# Altium schematic sheet RobotCtrl_V2_Core-board.SchDoc
size A3; Author: Power Lin; DocumentNumber: 1; SheetNumber: 1; SheetTotal: 1; Website: wiki-power.com
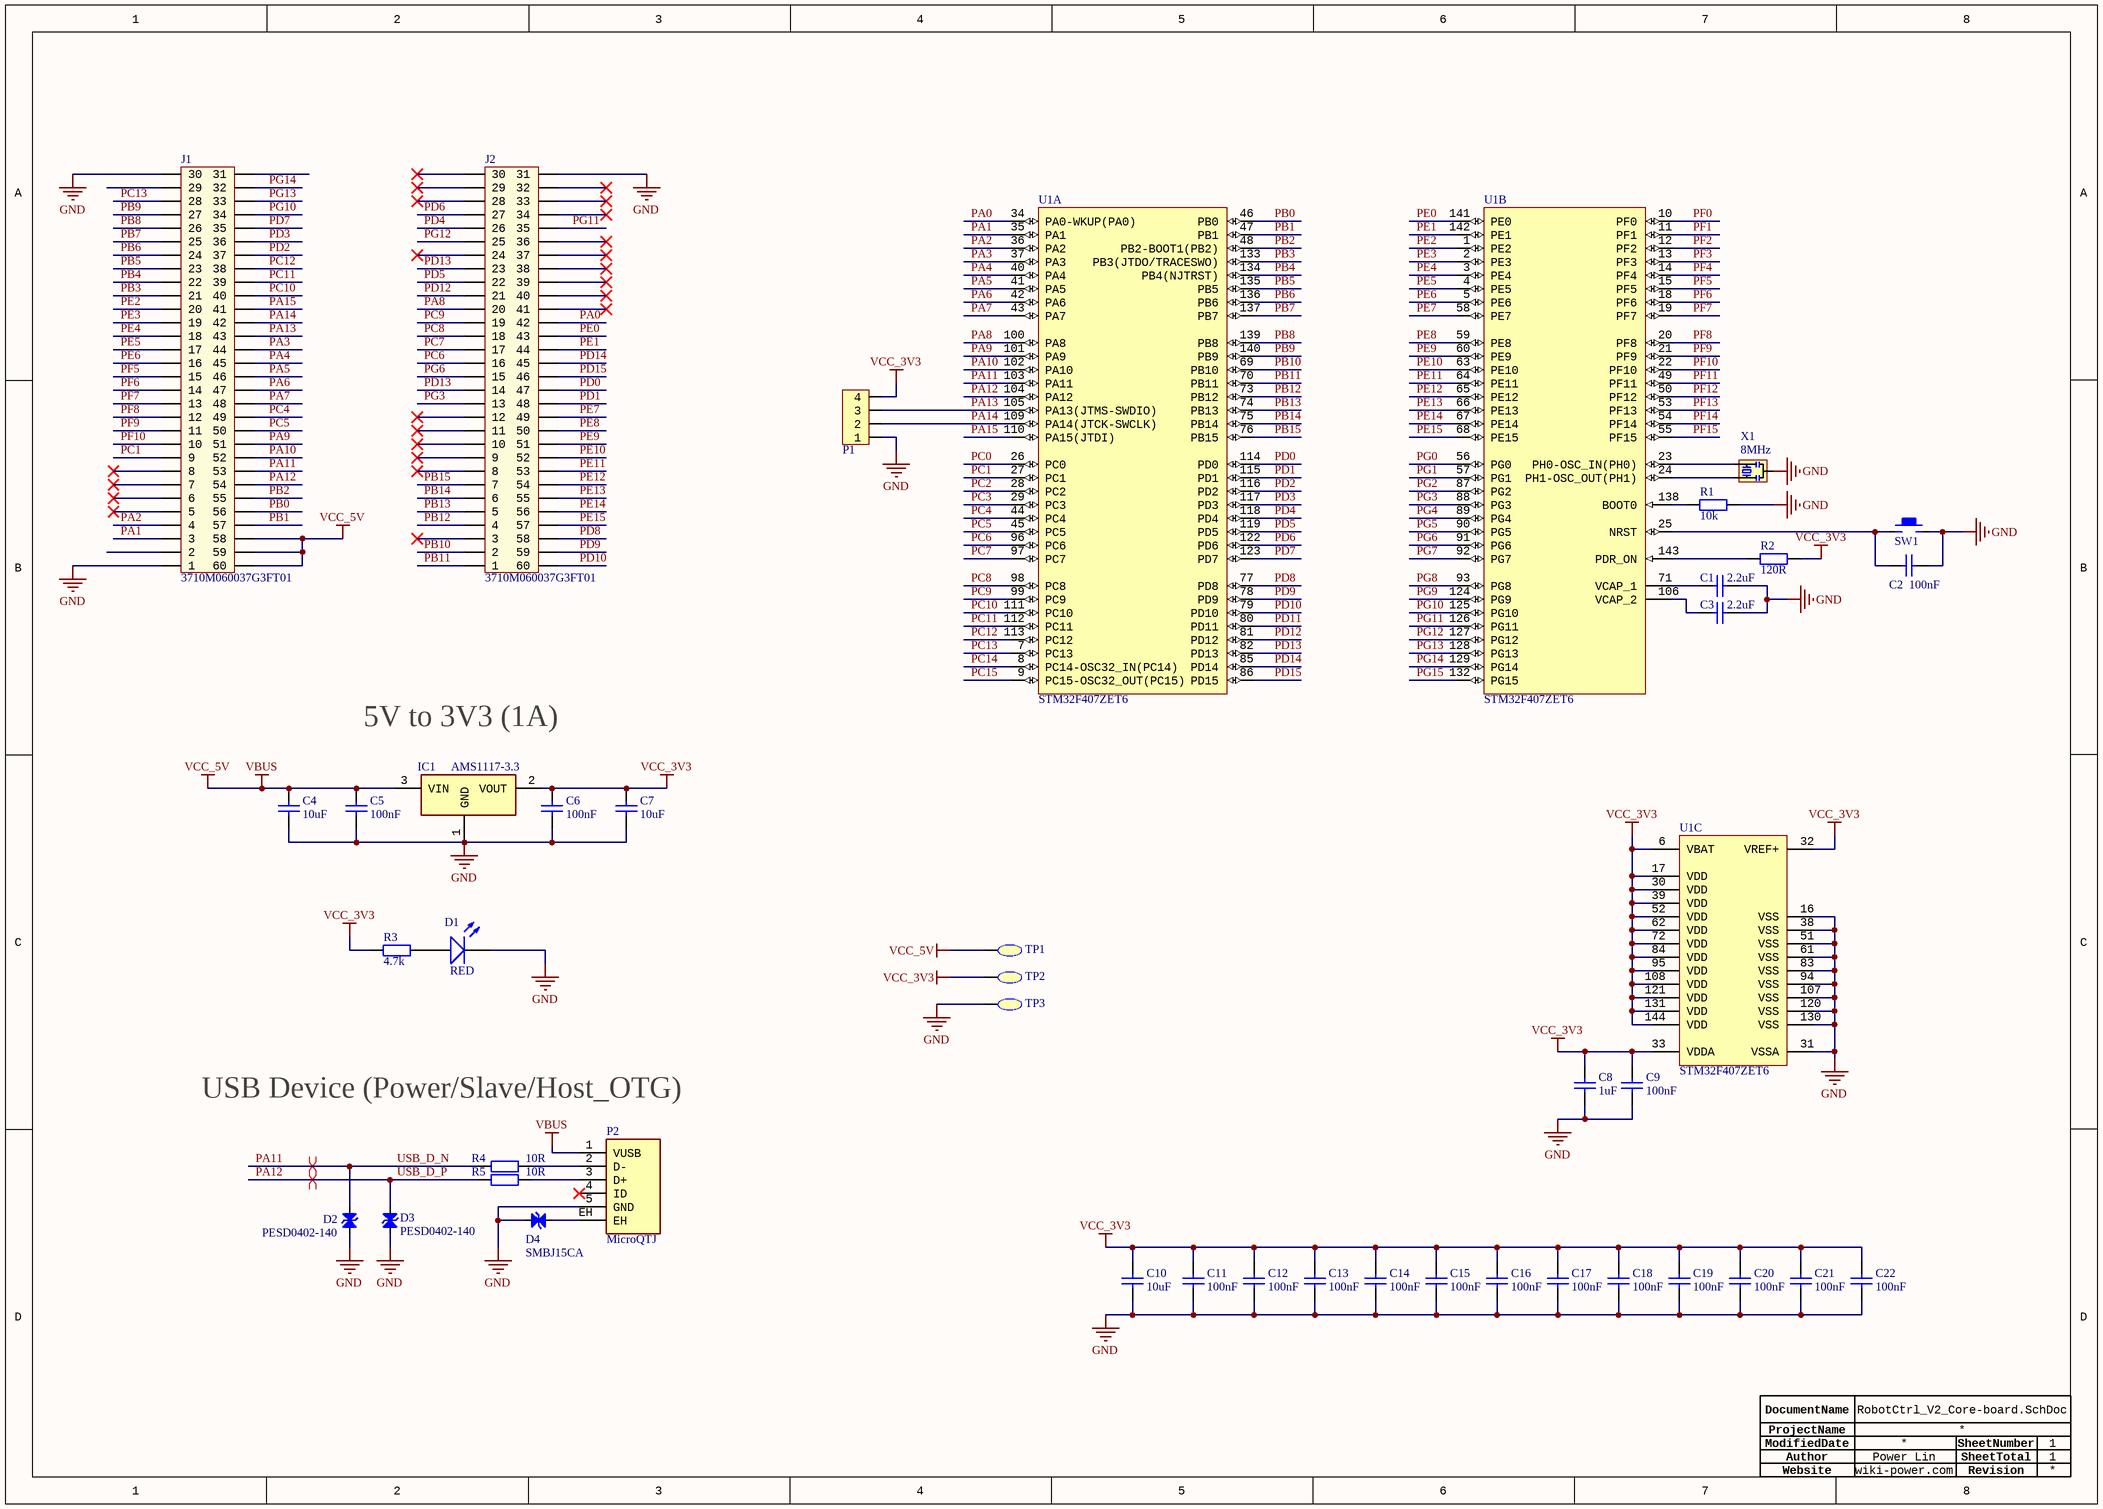
[diagram p0: RobotCtrl_V2_Core-board.SchDoc]

## Parts
C1  2.2uF  [CAP-0603]
C2  100nF  [CAP-0603]
C3  2.2uF  [CAP-0603]
C4  10uF  [CAP-0603]
C5  100nF  [CAP-0603]
C6  100nF  [CAP-0603]
C7  10uF  [CAP-0603]
C8  1uF  [CAP-0603]
C9  100nF  [CAP-0603]
C10  10uF  [CAP-0603]
C11  100nF  [CAP-0603]
C12  100nF  [CAP-0603]
C13  100nF  [CAP-0603]
C14  100nF  [CAP-0603]
C15  100nF  [CAP-0603]
C16  100nF  [CAP-0603]
C17  100nF  [CAP-0603]
C18  100nF  [CAP-0603]
C19  100nF  [CAP-0603]
C20  100nF  [CAP-0603]
C21  100nF  [CAP-0603]
C22  100nF  [CAP-0603]
D1  RED  [LED-0603]
D2  PESD0402-140  [D-0402]
D3  PESD0402-140  [D-0402]
D4  SMBJ15CA  [DO-214AA/SMB]
IC1  AMS1117-3.3  [SOT-223]
J1  3710M060037G3FT01  [3710M060037G3FT01]
J2  3710M060037G3FT01  [3710M060037G3FT01]
P1  HDR1x4_2.54  [HDR1x4_2.54_180]  (value not drawn)
P2  MicroQTJ  [USB-MICRO]
R1  10k  [R-0603]
R2  120R  [R-0603]
R3  4.7k  [R-0603]
R4  10R  [R-0603]
R5  10R  [R-0603]
SW1  KEY  [KEY-4P-4.2*3.4*2.5]  (value not drawn)
TP1  TestPoint  [TestPoint]  (value not drawn)
TP2  TestPoint  [TestPoint]  (value not drawn)
TP3  TestPoint  [TestPoint]  (value not drawn)
U1  STM32F407ZET6  [STM-LQFP144_N]  (parts A,B,C of 3)
X1  8MHz  [SMD3213-3P]

## Nets
GND: C1.2 C2.1 C3.2 C4.1 C5.1 C6.1 C7.1 C8.1 C9.1 C10.1 C11.1 C12.1 C13.1 C14.1 C15.1 C16.1 C17.1 C18.1 C19.1 C20.1 C21.1 C22.1 D1.K D2.1 D3.1 D4.2 IC1.1(GND) J1.1 J1.30 J2.31 P1.1 P2.5(GND) R1.1 SW1.2 TP3.1 U1.16(VSS) U1.31(VSSA) U1.38(VSS) U1.51(VSS) U1.61(VSS) U1.83(VSS) U1.94(VSS) U1.107(VSS) U1.120(VSS) U1.130(VSS) X1.2(GND)
VBUS: C4.2 C5.2 IC1.3(VIN) J1.58 J1.59 J1.60 P2.1(VUSB) TP1.1  [also labelled VCC_5V]
VCC_3V3: C6.2 C7.2 C8.2 C9.2 C10.2 C11.2 C12.2 C13.2 C14.2 C15.2 C16.2 C17.2 C18.2 C19.2 C20.2 C21.2 C22.2 IC1.2(VOUT) P1.4 R2.1 R3.2 TP2.1 U1.6(VBAT) U1.17(VDD) U1.30(VDD) U1.32(VREF+) U1.33(VDDA) U1.39(VDD) U1.52(VDD) U1.62(VDD) U1.72(VDD) U1.84(VDD) U1.95(VDD) U1.108(VDD) U1.121(VDD) U1.131(VDD) U1.144(VDD)
PA0: J2.42 U1.34(PA0-WKUP(PA0))
PA1: J1.3 U1.35(PA1)
PA2: J1.4 U1.36(PA2)
PA3: J1.44 U1.37(PA3)
PA4: J1.45 U1.40(PA4)
PA5: J1.46 U1.41(PA5)
PA6: J1.47 U1.42(PA6)
PA7: J1.48 U1.43(PA7)
PA8: J2.20 U1.100(PA8)
PA9: J1.51 U1.101(PA9)
PA10: J1.52 U1.102(PA10)
PA11: D2.2 J1.53 R4.1 U1.103(PA11)  [also labelled USB_D_N]
PA12: D3.2 J1.54 R5.1 U1.104(PA12)  [also labelled USB_D_P]
PA13: J1.43 P1.3 U1.105(PA13(JTMS-SWDIO))
PA14: J1.42 P1.2 U1.109(PA14(JTCK-SWCLK))
PA15: J1.41 U1.110(PA15(JTDI))
PB0: J1.56 U1.46(PB0)
PB1: J1.57 U1.47(PB1)
PB2: J1.55 U1.48(PB2-BOOT1(PB2))
PB3: J1.21 U1.133(PB3(JTDO/TRACESWO))
PB4: J1.22 U1.134(PB4(NJTRST))
PB5: J1.23 U1.135(PB5)
PB6: J1.24 U1.136(PB6)
PB7: J1.25 U1.137(PB7)
PB8: J1.26 U1.139(PB8)
PB9: J1.27 U1.140(PB9)
PB10: J2.2 U1.69(PB10)
PB11: J2.1 U1.70(PB11)
PB12: J2.4 U1.73(PB12)
PB13: J2.5 U1.74(PB13)
PB14: J2.6 U1.75(PB14)
PB15: J2.7 U1.76(PB15)
PC0: U1.26(PC0)
PC1: J1.9 U1.27(PC1)
PC2: U1.28(PC2)
PC3: U1.29(PC3)
PC4: J1.49 U1.44(PC4)
PC5: J1.50 U1.45(PC5)
PC6: J2.16 U1.96(PC6)
PC7: J2.17 U1.97(PC7)
PC8: J2.18 U1.98(PC8)
PC9: J2.19 U1.99(PC9)
PC10: J1.40 U1.111(PC10)
PC11: J1.39 U1.112(PC11)
PC12: J1.38 U1.113(PC12)
PC13: J1.28 U1.7(PC13)
PC14: U1.8(PC14-OSC32_IN(PC14))
PC15: U1.9(PC15-OSC32_OUT(PC15))
PD0: J2.47 U1.114(PD0)
PD1: J2.48 U1.115(PD1)
PD2: J1.37 U1.116(PD2)
PD3: J1.36 U1.117(PD3)
PD4: J2.26 U1.118(PD4)
PD5: J2.22 U1.119(PD5)
PD6: J2.27 U1.122(PD6)
PD7: J1.35 U1.123(PD7)
PD8: J2.58 U1.77(PD8)
PD9: J2.59 U1.78(PD9)
PD10: J2.60 U1.79(PD10)
PD11: U1.80(PD11)
PD12: J2.21 U1.81(PD12)
PD13: J2.14 J2.23 U1.82(PD13)
PD14: J2.45 U1.85(PD14)
PD15: J2.46 U1.86(PD15)
PE0: J2.43 U1.141(PE0)
PE1: J2.44 U1.142(PE1)
PE2: J1.20 U1.1(PE2)
PE3: J1.19 U1.2(PE3)
PE4: J1.18 U1.3(PE4)
PE5: J1.17 U1.4(PE5)
PE6: J1.16 U1.5(PE6)
PE7: J2.49 U1.58(PE7)
PE8: J2.50 U1.59(PE8)
PE9: J2.51 U1.60(PE9)
PE10: J2.52 U1.63(PE10)
PE11: J2.53 U1.64(PE11)
PE12: J2.54 U1.65(PE12)
PE13: J2.55 U1.66(PE13)
PE14: J2.56 U1.67(PE14)
PE15: J2.57 U1.68(PE15)
PF0: U1.10(PF0)
PF1: U1.11(PF1)
PF2: U1.12(PF2)
PF3: U1.13(PF3)
PF4: U1.14(PF4)
PF5: J1.15 U1.15(PF5)
PF6: J1.14 U1.18(PF6)
PF7: J1.13 U1.19(PF7)
PF8: J1.12 U1.20(PF8)
PF9: J1.11 U1.21(PF9)
PF10: J1.10 U1.22(PF10)
PF11: U1.49(PF11)
PF12: U1.50(PF12)
PF13: U1.53(PF13)
PF14: U1.54(PF14)
PF15: U1.55(PF15)
PG0: U1.56(PG0)
PG1: U1.57(PG1)
PG2: U1.87(PG2)
PG3: J2.13 U1.88(PG3)
PG4: U1.89(PG4)
PG5: U1.90(PG5)
PG6: J2.15 U1.91(PG6)
PG7: U1.92(PG7)
PG8: U1.93(PG8)
PG9: U1.124(PG9)
PG10: J1.34 U1.125(PG10)
PG11: J2.35 U1.126(PG11)
PG12: J2.25 U1.127(PG12)
PG13: J1.33 U1.128(PG13)
PG14: J1.32 U1.129(PG14)
PG15: U1.132(PG15)
NetC1_1: C1.1 U1.71(VCAP_1)
NetC2_2: C2.2 SW1.1 U1.25(NRST)
NetC3_1: C3.1 U1.106(VCAP_2)
NetD1_A: D1.A R3.1
NetD4_1: D4.1 P2.EH
NetP2_2: P2.2(D-) R4.2
NetP2_3: P2.3(D+) R5.2
NetR1_2: R1.2 U1.138(BOOT0)
NetR2_2: R2.2 U1.143(PDR_ON)
NetU1_23: U1.23(PH0-OSC_IN(PH0)) X1.3(OSC2)
NetU1_24: U1.24(PH1-OSC_OUT(PH1)) X1.1(OSC1)

Not connected (* = marked no-connect by the designer): J1 2 5* 6* 7* 8* 29 31; J2 3* 8* 9* 10* 11* 12* 24* 28* 29* 30* 32* 33* 34* 36* 37* 38* 39* 40* 41*; P2 4(ID)*

## Layout directives
differential pair: PA11, PA12

## Notes on the sheet
- 5V to 3V3 (1A)
- USB Device (Power/Slave/Host_OTG)
- Author
- DocumentName
- ModifiedDate
- ProjectName
- SheetNumber
- SheetTotal
- Website
- Revision

## Library data of the parts
C1-C22 = CAP: 贴片电容; ComponentLink1Description: 供应商链接; ComponentLink1URL: http://www.szlcsc.com/product/details_53938.html; Package: 0402; Supplier: LC; SuppliersPartNumber: C52923
D1 = LED: 发光二极管; pin to pad: A>1 K>2; ComponentLink1Description: 供应商链接; ComponentLink1URL: http://www.szlcsc.com/product/details_2663.html; Package: 0603; Supplier: LC; SuppliersPartNumber: C2290
D2-D4 = TVS_C
IC1 = AMS1117: AMS1117-3.3 1.0A; Manufacturer_Name: Nexperia; Manufacturer_Part_Number: SI2302DS; Datasheet Link: https://assets.nexperia.com/documents/data-sheet/SI2302DS.pdf; Height: 1.1mm; Mouser Part Number: N/A; Mouser Price/Stock: https://www.mouser.com/Search/Refine.aspx?Keyword=N%2FA; RS Part Number: 7983053P; RS Price/Stock: http://uk.rs-online.com/web/p/products/7983053P
J1 J2 = 3710M/F: B2B Connector
P1 = HDR1x4_2.54: Header
P2 = USB_MICRO
R1-R5 = RES: 贴片电阻; Package: 0805; Supplier: LC; SuppliersPartNumber: C17798
SW1 = KEY: 按键开关
TP1-TP3 = TestPoint: 测试点
U1 = STM32F407ZET6: ARM Cortex-M4 32-bit MCU+FPU, 210 DMIPS, 512 kB Flash, 192 kB Internal RAM, 114 I/Os, 144-pin LQFP, -40 to 85 degC, Tray; Manufacturer: STMicroelectronics; D/A Converter: 2x12-bit; FLASH Size (Prog) (kB): 512; I/Os (High Current): 114; Internal RAM Size (kB): 192; Operating Frequency(F) (Processor speed) (MHz): 168; Supply Voltage(Vcc) max (V): 3.6; Supply Voltage(Vcc) min (V): 1.8; DatasheetVersion: Rev. 4; PackageVersion: Rev. 4, 06/2013; PackageReference: LQFP144; PackageDescription: 144-Pin Low Profile Quad Flat Package, 20 x 20 mm Body, 0.5 mm Pitch; Supplier 1: Digi-Key; Supplier Part Number 1: 497-11903-ND; Supplier 2: Farnell; Supplier Part Number 2: 2215229; Supplier 3: Newark; Supplier Part Number 3: 46W2203; Supplier 4: Newark; Supplier Part Number 4: 87T3795; Supplier 5: Mouser; Supplier Part Number 5: 511-STM32F407ZET6; Core: ARM Cortex-M4; Packing: Tray; Mounting Technology: Surface Mount; PartNumber: STM32F407ZET6; ComponentLink1Description: Manufacturer URL; ComponentLink1URL: http://www.st.com/web/en/home.html; ComponentLink2Description: Datasheet; ComponentLink2URL: http://www.st.com/st-web-ui/static/active/en/resource/technical/document/datasheet/DM00037051.pdf; ComponentLink3Description: Package Specification; ComponentLink3URL: http://www.st.com/st-web-ui/static/active/en/resource/technical/document/datasheet/DM00037051.pdf
X1 = XTAL: CSTCE8M00G15C99-R0